# EAGLE design controller (EAGLE 9.6.2)
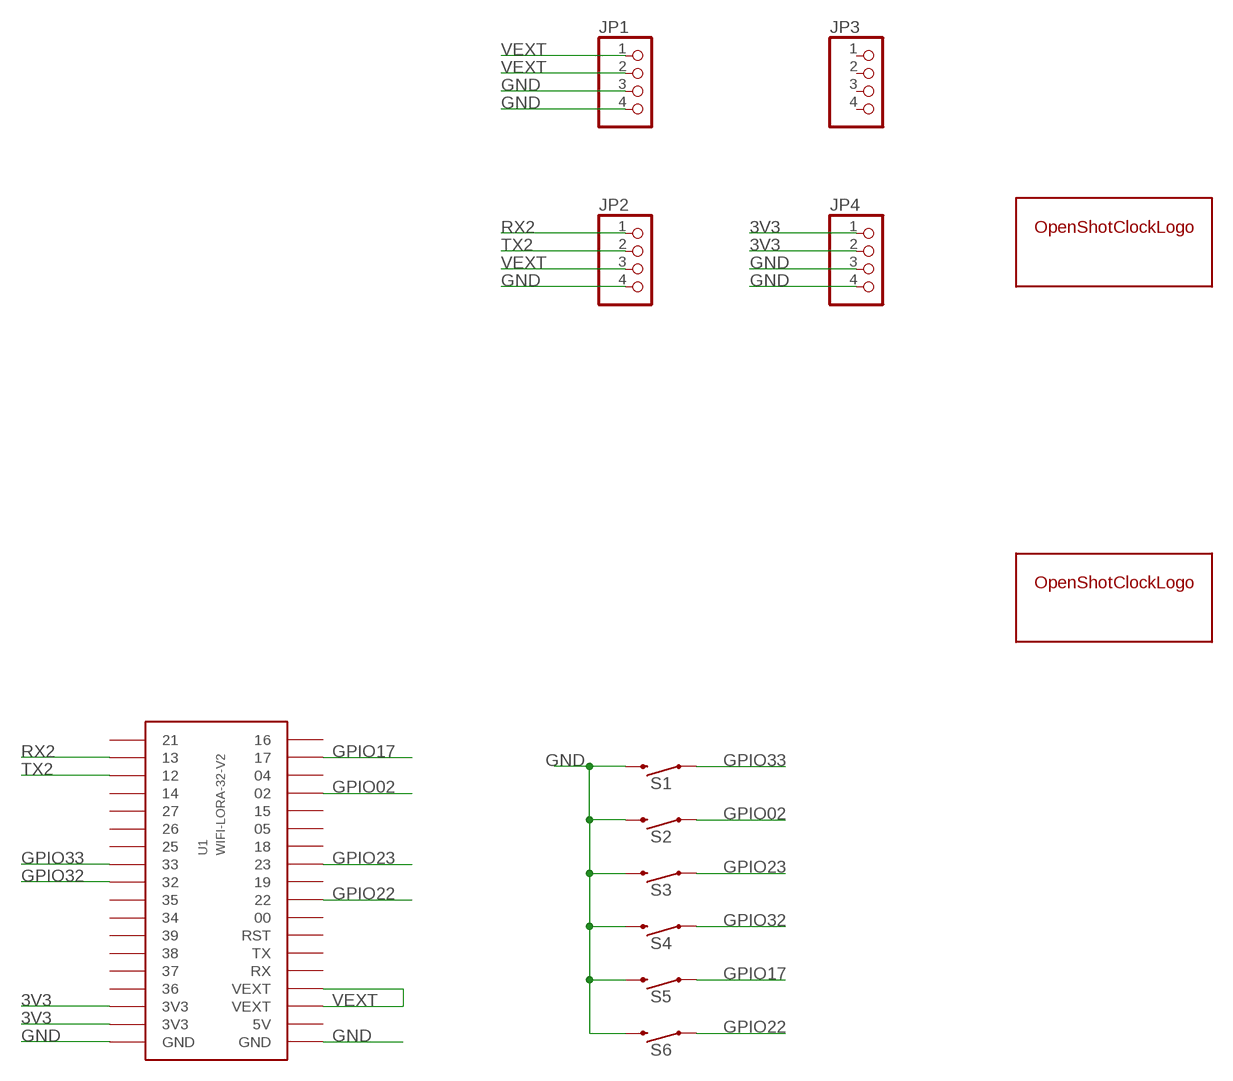
[diagram p0: schematic, sheet 1]

## Parts
JP1  PINHD-1X4  [1X04]
JP2  PINHD-1X4  [1X04]
JP3  PINHD-1X4  [1X04]
JP4  PINHD-1X4  [1X04]
S1  MOMENTARY-SWITCH-SPST-SMD-6.0X3.5MM  [TACTILE_SWITCH_SMD_6.0X3.5MM]
S2  MOMENTARY-SWITCH-SPST-SMD-6.0X3.5MM  [TACTILE_SWITCH_SMD_6.0X3.5MM]
S3  MOMENTARY-SWITCH-SPST-SMD-6.0X3.5MM  [TACTILE_SWITCH_SMD_6.0X3.5MM]
S4  MOMENTARY-SWITCH-SPST-SMD-6.0X3.5MM  [TACTILE_SWITCH_SMD_6.0X3.5MM]
S5  MOMENTARY-SWITCH-SPST-SMD-6.0X3.5MM  [TACTILE_SWITCH_SMD_6.0X3.5MM]
S6  MOMENTARY-SWITCH-SPST-SMD-6.0X3.5MM  [TACTILE_SWITCH_SMD_6.0X3.5MM]
U1  WIFI-LORA-32-V2  [2.54MM_2X18]
U$2  OPEN-SHOT-CLOCK-LOGOOSCL-SMALL  [OPEN-SHOT-CLOCK-LOGO-SMALL]
U$5  OPEN-SHOT-CLOCK-LOGOOSCL-SMALL  [OPEN-SHOT-CLOCK-LOGO-SMALL]

## Nets
3V3: JP4.1 JP4.2 U1.P$34(3V3) U1.P$35(3V3)
GND: JP1.3 JP1.4 JP2.4 JP4.3 JP4.4 S1.2 S2.2 S3.2 S4.2 S5.2 S6.2 U1.P$1(GND) U1.P$36(GND)
GPIO02: S2.1 U1.P$15
GPIO17: S5.1 U1.P$17
GPIO22: S6.1 U1.P$9
GPIO23: S3.1 U1.P$11
GPIO32: S4.1 U1.P$27
GPIO33: S1.1 U1.P$26
RX2: JP2.1 U1.P$20
TX2: JP2.2 U1.P$21
VEXT: JP1.1 JP1.2 JP2.3 U1.P$3(VEXT) U1.P$4(VEXT)
Unconnected: JP3.1 JP3.2 JP3.3 JP3.4 U1.P$2(5V) U1.P$5(RX) U1.P$6(TX) U1.P$7(RST) U1.P$8 U1.P$10 U1.P$12 U1.P$13 U1.P$14 U1.P$16 U1.P$18 U1.P$19 U1.P$22 U1.P$23 U1.P$24 U1.P$25 U1.P$28 U1.P$29 U1.P$30 U1.P$31 U1.P$32 U1.P$33

## Library data of the parts
JP1-JP4 = pinhead:PINHD-1X4: PIN HEADER
S1-S6 = SparkFun-Switches:MOMENTARY-SWITCH-SPST: Momentary Switch (Pushbutton) - SPST Normally-open (NO) SPST momentary switches (buttons, pushbuttons). Variants PTH-12MM - 12mm square, through-hole Momentary Pushbutton Switch - 12mm Square <https://www.sparkfun.com/products/9190> (COM-09190) PTH-6.0MM, PTH-6.0MM-KIT - 6.0mm square, through-hole Mini Pushbutton Switch <https://www.sparkfun.com/products/97> (COM-00097) KIT package intended for soldering kit's - only one side of pads' copper is exposed. PTH-RIGHT-ANGLE-KIT - Right-angle, through-hole Right Angle Tactile Button <https://www.sparkfun.com/products/10791> - Used on SparkFun BigTime Watch Kit <https://www.sparkfun.com/products/11734> SMD-12MM - 12mm square, surface-mount Tactile Button - SMD (12mm) <https://www.sparkfun.com/products/12993> (COM-12993) Used on SparkFun PicoBoard <https://www.sparkfun.com/products/11888> SMD-4.5MM - 4.5mm Square Trackball Switch Used on SparkFun Blackberry Trackballer Breakout <https://www.sparkfun.com/products/13169> SMD-4.6MMX2.8MM - 4.60mm x 2.80mm, surface mount Used on SparkFun SAMD21 Mini Breakout <https://www.sparkfun.com/products/13664> SMD-5.2MM, SMD-5.2-REDUNDANT - 5.2mm square, surface-mount Mini Pushbutton Switch - SMD <https://www.sparkfun.com/products/8720> (COM-08720) Used on Arduino Pro Mini <https://www.sparkfun.com/products/11114> REDUNDANT package connects both switch circuits together SMD-6.0X3.5MM - 6.0 x 3.5mm, surface mount Momentary Reset Switch SMD <https://www.sparkfun.com/products/8229> (COM-08229) SMD-6.2MM-TALL - 6.2mm square, surface mount Tactile Button - SMD (6mm) <https://www.sparkfun.com/products/12992> Used on SparkFun Digital Sandbox <https://www.sparkfun.com/products/12651> SMD-RIGHT-ANGLE - Right-angle, surface mount Used on SparkFun Block for Intel® Edison - Arduino <https://www.sparkfun.com/products/13036>; PROD_ID: SWCH-00815; SF_SKU: COM-08229
U1 = ESP32_modules:WIFI-LORA-32-V2
U$2 U$5 = openShotClockLogo:OPEN-SHOT-CLOCK-LOGO

## Board
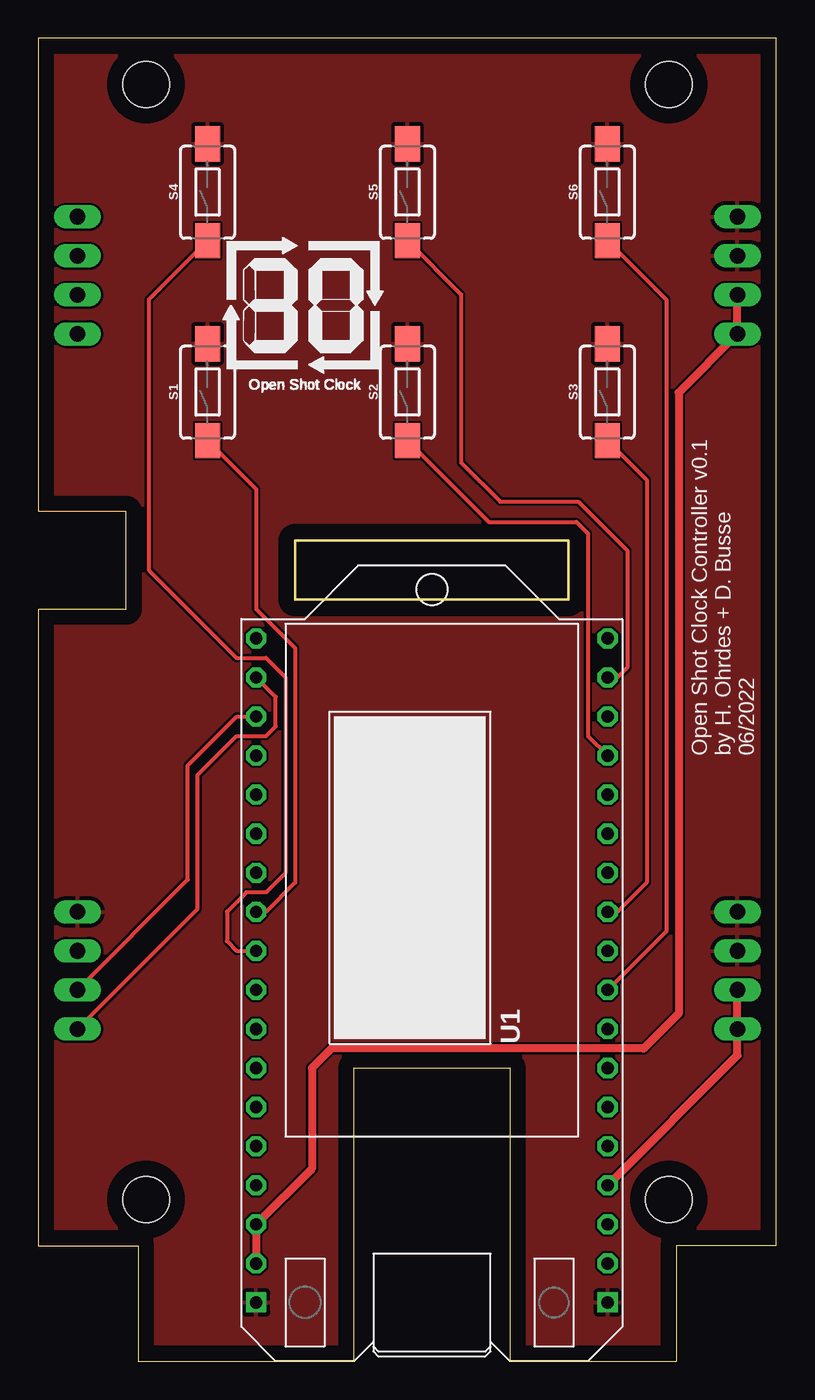
[diagram p1: board, top side]
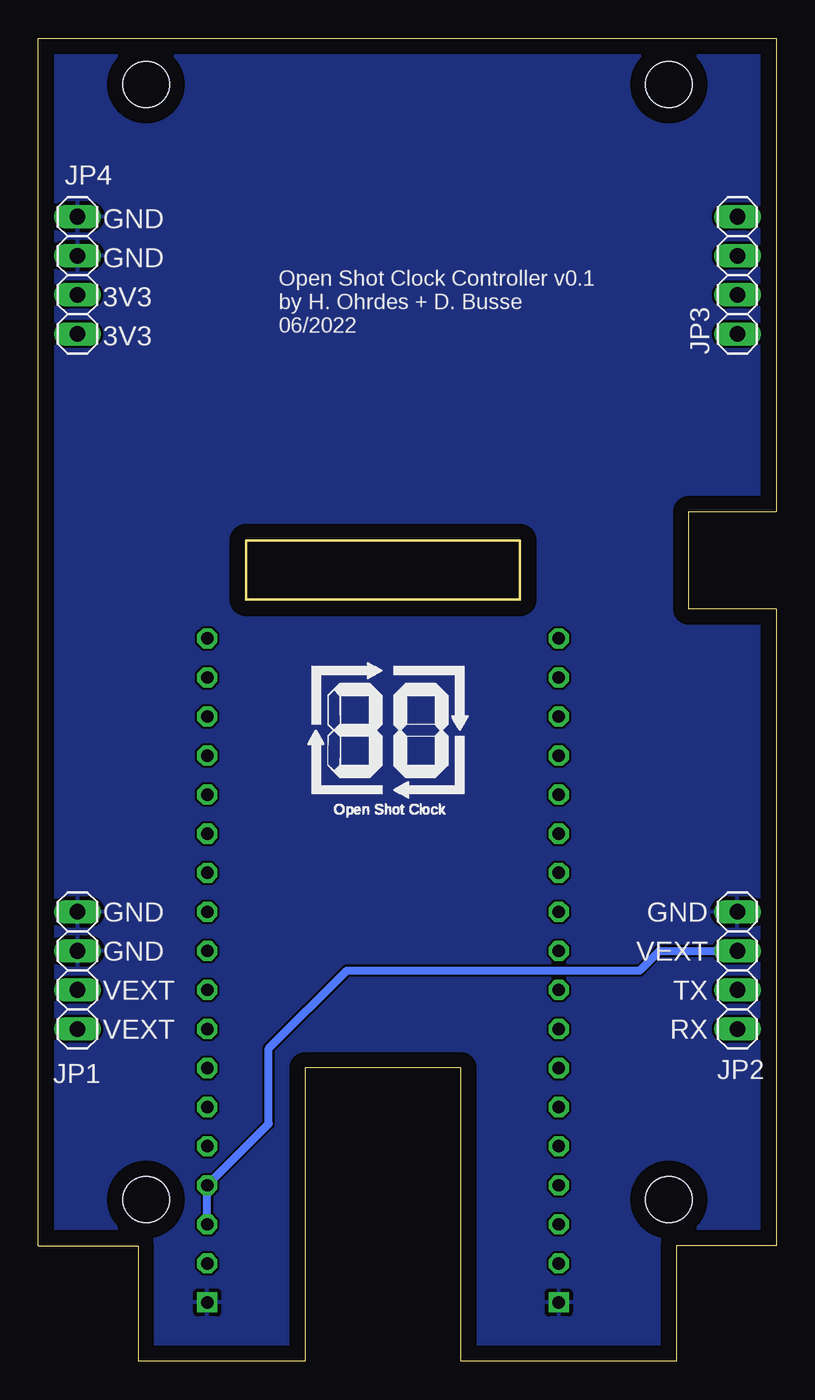
[diagram p2: board, bottom side, seen from below]

Size 48 x 86 mm. Coordinates in mm from the lower left corner, seen from the top.
Outline: 48,7.5 48,86 0,86 0,55.24 5.71,55.24 5.71,48.9 0,48.9 0,7.5 6.5,7.5 6.5,0 20.51,0 20.51,19.05 30.67,19.05 30.67,0 41.5,0 41.5,7.5 48,7.5
Outline: 16.7,53.34 34.48,53.34 34.48,49.53 16.7,49.53 16.7,53.34
Copper layers (1*16): Top 0.035mm / dielectric 1.5mm / Bottom 0.035mm
Design rules "default": minimum track width 6mil, minimum drill 0.35mm, track to track 6mil, track to pad 6mil, pad to pad 6mil, via to via 6mil, smd to smd 6mil, copper to edge 40mil, drill to drill 6mil, minimum pad ring 10mil, minimum via ring 8mil, stop-mask expansion 4mil, vias tented up to drill 0mil, thermal gap 10mil
Holes 3 mm at 7,10.5 41,10.5 7,83 41,83

### Footprints (pad centres in the part's own frame; a part is rotated, then mirrored left to right if it is on the bottom)
1X04 = drill 1.016 long: 1 -3.81,0; 2 -1.27,0; 3 1.27,0; 4 3.81,0
TACTILE_SWITCH_SMD_6.0X3.5MM = smd 2.3 x 1.6: 1 -3.15,0; 2 3.15,0
2.54MM_2X18 = drill 0.8 square: P$1 -20.32,-11.43; P$36 -20.32,11.43 | drill 0.8 octagon: P$2 -17.78,-11.43; P$3 -15.24,-11.43; P$4 -12.7,-11.43; P$5 -10.16,-11.43; P$6 -7.62,-11.43; P$7 -5.08,-11.43; P$8 -2.54,-11.43; P$9 0,-11.43; P$10 2.54,-11.43; P$11 5.08,-11.43; P$12 7.62,-11.43; P$13 10.16,-11.43; P$14 12.7,-11.43; P$15 15.24,-11.43; P$16 17.78,-11.43; P$17 20.32,-11.43; P$18 22.86,-11.43; P$19 22.86,11.43; P$20 20.32,11.43; P$21 17.78,11.43; P$22 15.24,11.43; P$23 12.7,11.43; P$24 10.16,11.43; P$25 7.62,11.43; P$26 5.08,11.43; P$27 2.54,11.43; P$28 0,11.43; P$29 -2.54,11.43; P$30 -5.08,11.43; P$31 -7.62,11.43; P$32 -10.16,11.43; P$33 -12.7,11.43; P$34 -15.24,11.43; P$35 -17.78,11.43

### Placement (x,y rotation side)
JP1  45.46,25.4 90 bottom
JP2  2.54,25.4 90 bottom
JP3  2.54,70.6 90 bottom
JP4  45.46,70.6 90 bottom
S1  11,63 90 top
S2  24,63 90 top
S3  37,63 90 top
S4  11,76 90 top
S5  24,76 90 top
S6  37,76 90 top
U1  25.59,24.13 90 top
U$2  30.48,35.37 0 bottom
U$5  12,63 0 top

### Tracks (layer width: path | path; a pad name or v marks a point on that pad's centre or on a via)
3V3
  Top 0.508: JP4.2 JP4.1 41.65,62.98 41.65,22.6 39.37,20.32 19.05,20.32 17.78,19.05 17.78,12.51 U1.P$34 U1.P$35
GND
  pour Top: -0.64,86.36 -0.64,0 48.58,0 48.58,86.36
  pour Bottom: -1.27,-0.64 49.84,-0.64 49.84,87 -1.27,87
GPIO02
  Top 0.254: S2.1 29.29,54.56 34.98,54.56 35.75,53.79 35.75,40.64 U1.P$15
GPIO17
  Top 0.254: S5.1 27.5,69.36 27.5,58.42 30.04,55.88 35.12,55.88 38.29,52.7 38.29,45.09 37.66,44.45 U1.P$17
GPIO22
  Top 0.254: S6.1 40.83,69.02 40.83,27.94 U1.P$9
GPIO23
  Top 0.254: S3.1 39.56,57.29 39.56,31.11 37.66,29.21 U1.P$11
GPIO32
  Top 0.254: S4.1 7.17,69.03 7.17,51.44 12.89,45.72 14.79,45.72 16.07,44.45 16.07,31.75 14.79,30.48 13.53,30.48 12.26,29.21 12.26,27.3 12.89,26.67 U1.P$27
GPIO33
  Top 0.254: S1.1 14.16,56.69 14.16,48.9 16.7,46.35 16.7,31.11 14.79,29.21 U1.P$26
RX2
  Top 0.254: JP2.1 10.35,29.4 10.35,38.1 12.89,40.64 14.79,40.64 15.43,41.27 15.43,43.18 U1.P$20
TX2
  Top 0.254: JP2.2 9.71,31.3 9.71,38.73 12.89,41.91 U1.P$21
VEXT
  Top 0.508: U1.P$4 45.46,19.87 JP1.1 JP1.2
  Bottom 0.508: U1.P$3 U1.P$4 33.02,15.43 33.02,20.32 27.94,25.4 8.89,25.4 7.62,26.67 JP2.3

### Text on the board
tNames: Open Shot Clock Controller v0.1 / by H. Ohrdes + D. Busse / 06/2022
bNames: GND | GND | 3V3 | Open Shot Clock Controller v0.1 / by H. Ohrdes + D. Busse / 06/2022 | 3V3 | GND | GND | VEXT | GND | TX | VEXT | RX | VEXT